# Altium schematic sheet MCU.SchDoc
size 420 x 297 mm; SheetNumber: 1; SheetTotal: 12
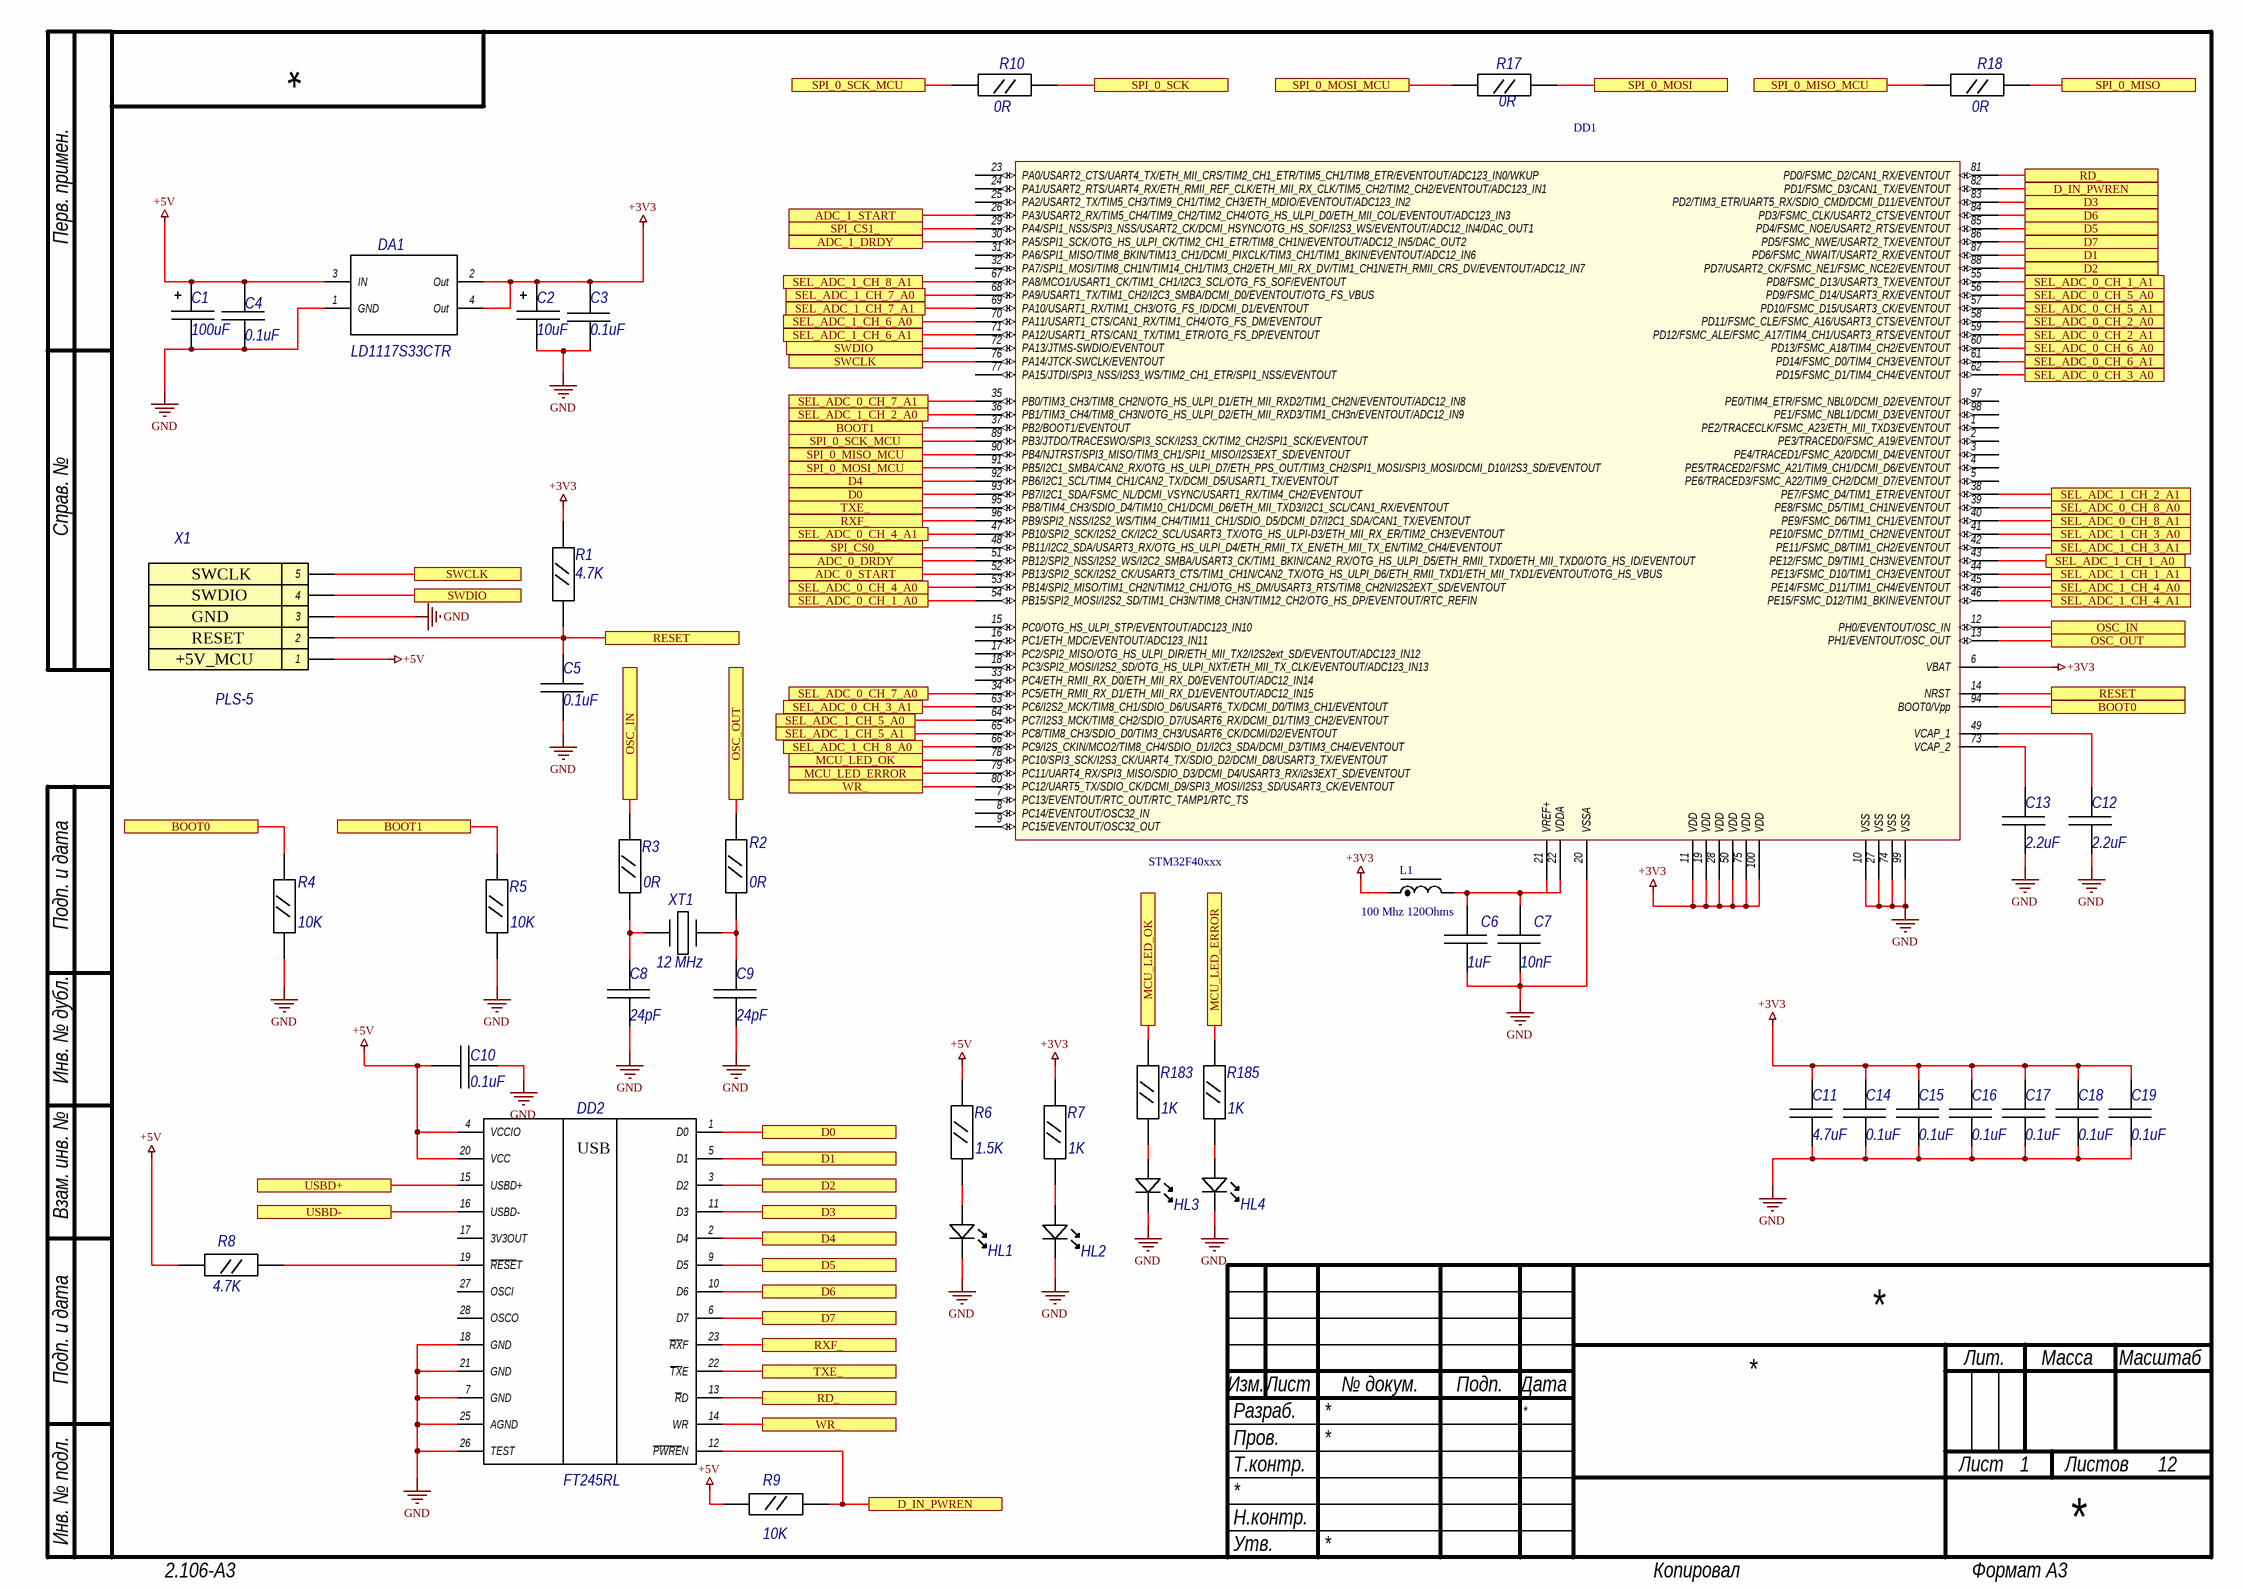
[diagram p0: MCU.SchDoc]

## Parts
C1  100uF  [CT_SMD_A]
C2  10uF  [CT_SMD_A]
C3  0.1uF  [C0603]
C4  0.1uF  [C0603]
C5  0.1uF  [C0603]
C6  1uF  [C0603]
C7  10nF  [C0603]
C8  24pF  [C0603]
C9  24pF  [C0603]
C10  0.1uF  [C0603]
C11  4.7uF  [C0603]
C12  2.2uF  [C0603]
C13  2.2uF  [C0603]
C14  0.1uF  [C0603]
C15  0.1uF  [C0603]
C16  0.1uF  [C0603]
C17  0.1uF  [C0603]
C18  0.1uF  [C0603]
C19  0.1uF  [C0603]
DA1  LD1117S33CTR  [SOT-223(DCY)]
DD1  STM32F40xxx  [QFP50P1600X1600X160-100N]
DD2  FT245RL  [SSOP-28N]
HL1  GREEN  [LED_0603]  (value not drawn)
HL2  GREEN  [LED_0603]  (value not drawn)
HL3  GREEN  [LED_0603]  (value not drawn)
HL4  GREEN  [LED_0603]  (value not drawn)
L1  100 Mhz 120Ohms  [0805]
R1  4.7K  [R0603]
R2  0R  [R0603]
R3  0R  [R0603]
R4  10K  [R0603]
R5  10K  [R0603]
R6  1.5K  [R0603]
R7  1K  [R0603]
R8  4.7K  [R0603]
R9  10K  [R0603]
R10  0R  [R0603]
R17  0R  [R0603]
R18  0R  [R0603]
R183  1K  [R0603]
R185  1K  [R0603]
X1  PLS-5  [PLS-5]
XT1  12 MHz  [HC49/US]

## Ports
ADC_0_DRDY, ADC_0_START, ADC_1_DRDY, ADC_1_START, BOOT0, BOOT1, D0, D1, D2, D3, D4, D5, D6, D7, D_IN_PWREN, MCU_LED_ERROR, MCU_LED_OK, OSC_IN, OSC_OUT, RD_, RESET, RXF_, SEL_ADC_0_CH_1_A0, SEL_ADC_0_CH_1_A1, SEL_ADC_0_CH_2_A0, SEL_ADC_0_CH_2_A1, SEL_ADC_0_CH_3_A0, SEL_ADC_0_CH_3_A1, SEL_ADC_0_CH_4_A0, SEL_ADC_0_CH_4_A1, SEL_ADC_0_CH_5_A0, SEL_ADC_0_CH_5_A1, SEL_ADC_0_CH_6_A0, SEL_ADC_0_CH_6_A1, SEL_ADC_0_CH_7_A0, SEL_ADC_0_CH_7_A1, SEL_ADC_0_CH_8_A0, SEL_ADC_0_CH_8_A1, SEL_ADC_1_CH_1_A0, SEL_ADC_1_CH_1_A1, SEL_ADC_1_CH_2_A0, SEL_ADC_1_CH_2_A1, SEL_ADC_1_CH_3_A0, SEL_ADC_1_CH_3_A1, SEL_ADC_1_CH_4_A0, SEL_ADC_1_CH_4_A1, SEL_ADC_1_CH_5_A0, SEL_ADC_1_CH_5_A1, SEL_ADC_1_CH_6_A0, SEL_ADC_1_CH_6_A1, SEL_ADC_1_CH_7_A0, SEL_ADC_1_CH_7_A1, SEL_ADC_1_CH_8_A0, SEL_ADC_1_CH_8_A1, SPI_0_MISO, SPI_0_MISO_MCU, SPI_0_MOSI, SPI_0_MOSI_MCU, SPI_0_SCK, SPI_0_SCK_MCU, SPI_CS0_, SPI_CS1_, SWCLK, SWDIO, TXE_, USBD+, USBD-, WR_

## Nets
+3V3: C2.1 C3.2 C11.2 C14.2 C15.2 C16.2 C17.2 C18.2 C19.2 DA1.2(Out) DA1.4(Out) DD1.6(VBAT) DD1.11(VDD) DD1.19(VDD) DD1.28(VDD) DD1.50(VDD) DD1.75(VDD) DD1.100(VDD) L1.1 R1.2 R7.2
+5V: C1.1 C4.2 C10.2 DA1.3(IN) DD2.4(VCCIO) DD2.20(VCC) R6.2 R8.2 R9.1 X1.1
GND: C1.2 C2.2 C3.1 C4.1 C5.1 C6.1 C7.1 C8.1 C9.1 C10.1 C11.1 C12.1 C13.1 C14.1 C15.1 C16.1 C17.1 C18.1 C19.1 DA1.1(GND) DD1.10(VSS) DD1.20(VSSA) DD1.27(VSS) DD1.74(VSS) DD1.99(VSS) DD2.7(GND) DD2.18(GND) DD2.21(GND) DD2.25(AGND) DD2.26(TEST) HL1.K HL2.K HL3.K HL4.K R4.1 R5.1 X1.3
ADC_0_DRDY: DD1.51(PB12/SPI2_NSS/I2S2_WS/I2C2_SMBA/USART3_CK/TIM1_BKIN/CAN2_RX/OTG_HS_ULPI_D5/ETH_RMII_TXD0/ETH_MII_TXD0/OTG_HS_ID/EVENTOUT) ; port ADC_0_DRDY
ADC_0_START: DD1.52(PB13/SPI2_SCK/I2S2_CK/USART3_CTS/TIM1_CH1N/CAN2_TX/OTG_HS_ULPI_D6/ETH_RMII_TXD1/ETH_MII_TXD1/EVENTOUT/OTG_HS_VBUS) ; port ADC_0_START
ADC_1_DRDY: DD1.30(PA5/SPI1_SCK/OTG_HS_ULPI_CK/TIM2_CH1_ETR/TIM8_CH1N/EVENTOUT/ADC12_IN5/DAC_OUT2) ; port ADC_1_DRDY
ADC_1_START: DD1.26(PA3/USART2_RX/TIM5_CH4/TIM9_CH2/TIM2_CH4/OTG_HS_ULPI_D0/ETH_MII_COL/EVENTOUT/ADC123_IN3) ; port ADC_1_START
BOOT0: DD1.94(BOOT0/Vpp) R4.2 ; port BOOT0
BOOT1: DD1.37(PB2/BOOT1/EVENTOUT) R5.2 ; port BOOT1
D0: DD1.93(PB7/I2C1_SDA/FSMC_NL/DCMI_VSYNC/USART1_RX/TIM4_CH2/EVENTOUT) DD2.1(D0) ; port D0
D1: DD1.87(PD6/FSMC_NWAIT/USART2_RX/EVENTOUT) DD2.5(D1) ; port D1
D2: DD1.88(PD7/USART2_CK/FSMC_NE1/FSMC_NCE2/EVENTOUT) DD2.3(D2) ; port D2
D3: DD1.83(PD2/TIM3_ETR/UART5_RX/SDIO_CMD/DCMI_D11/EVENTOUT) DD2.11(D3) ; port D3
D4: DD1.92(PB6/I2C1_SCL/TIM4_CH1/CAN2_TX/DCMI_D5/USART1_TX/EVENTOUT) DD2.2(D4) ; port D4
D5: DD1.85(PD4/FSMC_NOE/USART2_RTS/EVENTOUT) DD2.9(D5) ; port D5
D6: DD1.84(PD3/FSMC_CLK/USART2_CTS/EVENTOUT) DD2.10(D6) ; port D6
D7: DD1.86(PD5/FSMC_NWE/USART2_TX/EVENTOUT) DD2.6(D7) ; port D7
D_IN_PWREN: DD1.82(PD1/FSMC_D3/CAN1_TX/EVENTOUT) DD2.12(~{PWRE}N) R9.2 ; port D_IN_PWREN
MCU_LED_ERROR: DD1.79(PC11/UART4_RX/SPI3_MISO/SDIO_D3/DCMI_D4/USART3_RX/i2s3EXT_SD/EVENTOUT) R185.2 ; port MCU_LED_ERROR
MCU_LED_OK: DD1.78(PC10/SPI3_SCK/I2S3_CK/UART4_TX/SDIO_D2/DCMI_D8/USART3_TX/EVENTOUT) R183.2 ; port MCU_LED_OK
OSC_IN: DD1.12(PH0/EVENTOUT/OSC_IN) R3.2 ; port OSC_IN
OSC_OUT: DD1.13(PH1/EVENTOUT/OSC_OUT) R2.2 ; port OSC_OUT
RD_: DD1.81(PD0/FSMC_D2/CAN1_RX/EVENTOUT) DD2.13(~{R}D) ; port RD_
RESET: C5.2 DD1.14(NRST) R1.1 X1.2 ; port RESET
RXF_: DD1.96(PB9/SPI2_NSS/I2S2_WS/TIM4_CH4/TIM11_CH1/SDIO_D5/DCMI_D7/I2C1_SDA/CAN1_TX/EVENTOUT) DD2.23(~{RX}F) ; port RXF_
SEL_ADC_0_CH_1_A0: DD1.54(PB15/SPI2_MOSI/I2S2_SD/TIM1_CH3N/TIM8_CH3N/TIM12_CH2/OTG_HS_DP/EVENTOUT/RTC_REFIN) ; port SEL_ADC_0_CH_1_A0
SEL_ADC_0_CH_1_A1: DD1.55(PD8/FSMC_D13/USART3_TX/EVENTOUT) ; port SEL_ADC_0_CH_1_A1
SEL_ADC_0_CH_2_A0: DD1.58(PD11/FSMC_CLE/FSMC_A16/USART3_CTS/EVENTOUT) ; port SEL_ADC_0_CH_2_A0
SEL_ADC_0_CH_2_A1: DD1.59(PD12/FSMC_ALE/FSMC_A17/TIM4_CH1/USART3_RTS/EVENTOUT) ; port SEL_ADC_0_CH_2_A1
SEL_ADC_0_CH_3_A0: DD1.62(PD15/FSMC_D1/TIM4_CH4/EVENTOUT) ; port SEL_ADC_0_CH_3_A0
SEL_ADC_0_CH_3_A1: DD1.63(PC6/I2S2_MCK/TIM8_CH1/SDIO_D6/USART6_TX/DCMI_D0/TIM3_CH1/EVENTOUT) ; port SEL_ADC_0_CH_3_A1
SEL_ADC_0_CH_4_A0: DD1.53(PB14/SPI2_MISO/TIM1_CH2N/TIM12_CH1/OTG_HS_DM/USART3_RTS/TIM8_CH2N/I2S2EXT_SD/EVENTOUT) ; port SEL_ADC_0_CH_4_A0
SEL_ADC_0_CH_4_A1: DD1.47(PB10/SPI2_SCK/I2S2_CK/I2C2_SCL/USART3_TX/OTG_HS_ULPI-D3/ETH_MII_RX_ER/TIM2_CH3/EVENTOUT) ; port SEL_ADC_0_CH_4_A1
SEL_ADC_0_CH_5_A0: DD1.56(PD9/FSMC_D14/USART3_RX/EVENTOUT) ; port SEL_ADC_0_CH_5_A0
SEL_ADC_0_CH_5_A1: DD1.57(PD10/FSMC_D15/USART3_CK/EVENTOUT) ; port SEL_ADC_0_CH_5_A1
SEL_ADC_0_CH_6_A0: DD1.60(PD13/FSMC_A18/TIM4_CH2/EVENTOUT) ; port SEL_ADC_0_CH_6_A0
SEL_ADC_0_CH_6_A1: DD1.61(PD14/FSMC_D0/TIM4_CH3/EVENTOUT) ; port SEL_ADC_0_CH_6_A1
SEL_ADC_0_CH_7_A0: DD1.34(PC5/ETH_RMII_RX_D1/ETH_MII_RX_D1/EVENTOUT/ADC12_IN15) ; port SEL_ADC_0_CH_7_A0
SEL_ADC_0_CH_7_A1: DD1.35(PB0/TIM3_CH3/TIM8_CH2N/OTG_HS_ULPI_D1/ETH_MII_RXD2/TIM1_CH2N/EVENTOUT/ADC12_IN8) ; port SEL_ADC_0_CH_7_A1
SEL_ADC_0_CH_8_A0: DD1.39(PE8/FSMC_D5/TIM1_CH1N/EVENTOUT) ; port SEL_ADC_0_CH_8_A0
SEL_ADC_0_CH_8_A1: DD1.40(PE9/FSMC_D6/TIM1_CH1/EVENTOUT) ; port SEL_ADC_0_CH_8_A1
SEL_ADC_1_CH_1_A0: DD1.43(PE12/FSMC_D9/TIM1_CH3N/EVENTOUT) ; port SEL_ADC_1_CH_1_A0
SEL_ADC_1_CH_1_A1: DD1.44(PE13/FSMC_D10/TIM1_CH3/EVENTOUT) ; port SEL_ADC_1_CH_1_A1
SEL_ADC_1_CH_2_A0: DD1.36(PB1/TIM3_CH4/TIM8_CH3N/OTG_HS_ULPI_D2/ETH_MII_RXD3/TIM1_CH3n/EVENTOUT/ADC12_IN9) ; port SEL_ADC_1_CH_2_A0
SEL_ADC_1_CH_2_A1: DD1.38(PE7/FSMC_D4/TIM1_ETR/EVENTOUT) ; port SEL_ADC_1_CH_2_A1
SEL_ADC_1_CH_3_A0: DD1.41(PE10/FSMC_D7/TIM1_CH2N/EVENTOUT) ; port SEL_ADC_1_CH_3_A0
SEL_ADC_1_CH_3_A1: DD1.42(PE11/FSMC_D8/TIM1_CH2/EVENTOUT) ; port SEL_ADC_1_CH_3_A1
SEL_ADC_1_CH_4_A0: DD1.45(PE14/FSMC_D11/TIM1_CH4/EVENTOUT) ; port SEL_ADC_1_CH_4_A0
SEL_ADC_1_CH_4_A1: DD1.46(PE15/FSMC_D12/TIM1_BKIN/EVENTOUT) ; port SEL_ADC_1_CH_4_A1
SEL_ADC_1_CH_5_A0: DD1.64(PC7/I2S3_MCK/TIM8_CH2/SDIO_D7/USART6_RX/DCMI_D1/TIM3_CH2/EVENTOUT) ; port SEL_ADC_1_CH_5_A0
SEL_ADC_1_CH_5_A1: DD1.65(PC8/TIM8_CH3/SDIO_D0/TIM3_CH3/USART6_CK/DCMI/D2/EVENTOUT) ; port SEL_ADC_1_CH_5_A1
SEL_ADC_1_CH_6_A0: DD1.70(PA11/USART1_CTS/CAN1_RX/TIM1_CH4/OTG_FS_DM/EVENTOUT) ; port SEL_ADC_1_CH_6_A0
SEL_ADC_1_CH_6_A1: DD1.71(PA12/USART1_RTS/CAN1_TX/TIM1_ETR/OTG_FS_DP/EVENTOUT) ; port SEL_ADC_1_CH_6_A1
SEL_ADC_1_CH_7_A0: DD1.68(PA9/USART1_TX/TIM1_CH2/I2C3_SMBA/DCMI_D0/EVENTOUT/OTG_FS_VBUS) ; port SEL_ADC_1_CH_7_A0
SEL_ADC_1_CH_7_A1: DD1.69(PA10/USART1_RX/TIM1_CH3/OTG_FS_ID/DCMI_D1/EVENTOUT) ; port SEL_ADC_1_CH_7_A1
SEL_ADC_1_CH_8_A0: DD1.66(PC9/I2S_CKIN/MCO2/TIM8_CH4/SDIO_D1/I2C3_SDA/DCMI_D3/TIM3_CH4/EVENTOUT) ; port SEL_ADC_1_CH_8_A0
SEL_ADC_1_CH_8_A1: DD1.67(PA8/MCO1/USART1_CK/TIM1_CH1/I2C3_SCL/OTG_FS_SOF/EVENTOUT) ; port SEL_ADC_1_CH_8_A1
SPI_0_MISO: R18.1 ; port SPI_0_MISO
SPI_0_MISO_MCU: DD1.90(PB4/NJTRST/SPI3_MISO/TIM3_CH1/SPI1_MISO/I2S3EXT_SD/EVENTOUT) R18.2 ; port SPI_0_MISO_MCU
SPI_0_MOSI: R17.1 ; port SPI_0_MOSI
SPI_0_MOSI_MCU: DD1.91(PB5/I2C1_SMBA/CAN2_RX/OTG_HS_ULPI_D7/ETH_PPS_OUT/TIM3_CH2/SPI1_MOSI/SPI3_MOSI/DCMI_D10/I2S3_SD/EVENTOUT) R17.2 ; port SPI_0_MOSI_MCU
SPI_0_SCK: R10.1 ; port SPI_0_SCK
SPI_0_SCK_MCU: DD1.89(PB3/JTDO/TRACESWO/SPI3_SCK/I2S3_CK/TIM2_CH2/SPI1_SCK/EVENTOUT) R10.2 ; port SPI_0_SCK_MCU
SPI_CS0_: DD1.48(PB11/I2C2_SDA/USART3_RX/OTG_HS_ULPI_D4/ETH_RMII_TX_EN/ETH_MII_TX_EN/TIM2_CH4/EVENTOUT) ; port SPI_CS0_
SPI_CS1_: DD1.29(PA4/SPI1_NSS/SPI3_NSS/USART2_CK/DCMI_HSYNC/OTG_HS_SOF/I2S3_WS/EVENTOUT/ADC12_IN4/DAC_OUT1) ; port SPI_CS1_
SWCLK: DD1.76(PA14/JTCK-SWCLK/EVENTOUT) X1.5 ; port SWCLK
SWDIO: DD1.72(PA13/JTMS-SWDIO/EVENTOUT) X1.4 ; port SWDIO
TXE_: DD1.95(PB8/TIM4_CH3/SDIO_D4/TIM10_CH1/DCMI_D6/ETH_MII_TXD3/I2C1_SCL/CAN1_RX/EVENTOUT) DD2.22(~{TX}E) ; port TXE_
USBD+: DD2.15(USBD+) ; port USBD+
USBD-: DD2.16(USBD-) ; port USBD-
WR_: DD1.80(PC12/UART5_TX/SDIO_CK/DCMI_D9/SPI3_MOSI/I2S3_SD/USART3_CK/EVENTOUT) DD2.14(WR) ; port WR_
NetC6_2: C6.2 C7.2 DD1.21(VREF+) DD1.22(VDDA) L1.2
NetC8_2: C8.2 R3.1 XT1.2(OUT)
NetC9_2: C9.2 R2.1 XT1.1(IN)
NetC12_2: C12.2 DD1.49(VCAP_1)
NetC13_2: C13.2 DD1.73(VCAP_2)
NetDD2_19: DD2.19(~{RESE}T) R8.1
NetHL1_A: HL1.A R6.1
NetHL2_A: HL2.A R7.1
NetHL3_A: HL3.A R183.1
NetHL4_A: HL4.A R185.1

Not connected (* = marked no-connect by the designer): DD1 1(PE2/TRACECLK/FSMC_A23/ETH_MII_TXD3/EVENTOUT) 2(PE3/TRACED0/FSMC_A19/EVENTOUT) 3(PE4/TRACED1/FSMC_A20/DCMI_D4/EVENTOUT) 4(PE5/TRACED2/FSMC_A21/TIM9_CH1/DCMI_D6/EVENTOUT) 5(PE6/TRACED3/FSMC_A22/TIM9_CH2/DCMI_D7/EVENTOUT) 7(PC13/EVENTOUT/RTC_OUT/RTC_TAMP1/RTC_TS) 8(PC14/EVENTOUT/OSC32_IN) 9(PC15/EVENTOUT/OSC32_OUT) 15(PC0/OTG_HS_ULPI_STP/EVENTOUT/ADC123_IN10) 16(PC1/ETH_MDC/EVENTOUT/ADC123_IN11) 17(PC2/SPI2_MISO/OTG_HS_ULPI_DIR/ETH_MII_TX2/I2S2ext_SD/EVENTOUT/ADC123_IN12) 18(PC3/SPI2_MOSI/I2S2_SD/OTG_HS_ULPI_NXT/ETH_MII_TX_CLK/EVENTOUT/ADC123_IN13) 23(PA0/USART2_CTS/UART4_TX/ETH_MII_CRS/TIM2_CH1_ETR/TIM5_CH1/TIM8_ETR/EVENTOUT/ADC123_IN0/WKUP) 24(PA1/USART2_RTS/UART4_RX/ETH_RMII_REF_CLK/ETH_MII_RX_CLK/TIM5_CH2/TIM2_CH2/EVENTOUT/ADC123_IN1) 25(PA2/USART2_TX/TIM5_CH3/TIM9_CH1/TIM2_CH3/ETH_MDIO/EVENTOUT/ADC123_IN2) 31(PA6/SPI1_MISO/TIM8_BKIN/TIM13_CH1/DCMI_PIXCLK/TIM3_CH1/TIM1_BKIN/EVENTOUT/ADC12_IN6) 32(PA7/SPI1_MOSI/TIM8_CH1N/TIM14_CH1/TIM3_CH2/ETH_MII_RX_DV/TIM1_CH1N/ETH_RMII_CRS_DV/EVENTOUT/ADC12_IN7) 33(PC4/ETH_RMII_RX_D0/ETH_MII_RX_D0/EVENTOUT/ADC12_IN14) 77(PA15/JTDI/SPI3_NSS/I2S3_WS/TIM2_CH1_ETR/SPI1_NSS/EVENTOUT) 97(PE0/TIM4_ETR/FSMC_NBL0/DCMI_D2/EVENTOUT) 98(PE1/FSMC_NBL1/DCMI_D3/EVENTOUT); DD2 17(3V3OUT) 27(OSCI) 28(OSCO)

## Notes on the sheet
- SWCLK
- +5V_MCU
- RESET
- GND
- SWDIO
- Перв. примен.
- Справ. №
- Подп. и дата
- Инв. № дубл.
- Взам. инв. №
- Разраб.
- Изм.
- Лист
- № докум.
- Подп.
- Дата
- Лит.
- Масса
- Масштаб
- Пров.
- Т.контр.
- Листов
- Инв. № подл.
- Утв.
- Н.контр.
- 2.106-A3
- Копировал
- Формат А3
- (in symbol FT245RL) USB

## Library data of the parts
C1 C2 = CT_SMD_A: Capacitor tantalum; Package: SMD_A
  C1: Value: 100uF
  C2: Value: 10uF
C3-C19 = CC_SMD_0603: Ceramic Capacitor SMD; Package: 0603
  C3-C5 C10 C14-C19: Value: 0.1uF
  C6: Value: 1uF
  C7: Value: 10nF
  C8 C9: Value: 24pF
  C11: Value: 4.7uF
  C12 C13: Value: 2.2uF
DA1 = LD1117S33CTR: LDO; PartNumber: LD1117S33CTR; Package: SOT-223
DD1 = STM32F40xxx: ARM CortexM4 32b
DD2 = FT245RL: USB to parallel FIFO interface; Manufacturer: FTDI; Desc: Микросхема; Part Number: FT245RL; Package: 28 Pin SSOP
HL1-HL4 = LED_G_SMD_0603: LED GREEN SMD 0603; PartNumber: FYLS-0603PGC; Package: 0603; ComponentLink1URL: http://www.us.kingbright.com/images/catalog/SPEC/APT1608CGCK.pdf; ComponentLink1Description: http://www.us.kingbright.com/images/catalog/SPEC/APT1608CGCK.pdf; Color: GREEN
L1 = FerriteBead_0805: FerriteBead; PartNumber: BLM21PG121SN1D; Package: 0805; Value: 100 Mhz 120Ohms
R1-R10 R17 R18 R183 R185 = R0603: Resistor SMD
  R1 R8: Value: 4.7K
  R2 R3 R10 R17 R18: Value: 0R
  R4 R5 R9: Value: 10K
  R6: Value: 1.5K
  R7 R183 R185: Value: 1K
X1 = PLS-5: 5 pin connector, 2.54 step; PartNumber: 825433-5; Value: PLS-5
XT1 = Quarz HC-49/US 12 MHz: Quarz ESR 50 Ohms, Frequency Stability ±30ppm, Load Capacitance 18 pF; PartNumber: J49SML-F-G-G-K-12M0; Package: HC49/US; ComponentLink1Description: Link; ComponentLink1URL: https://abracon.com/Resonators/ABLS2.pdf; Value: 12 MHz